# EAGLE design Grove-LED v1.0 (EAGLE 5.10)
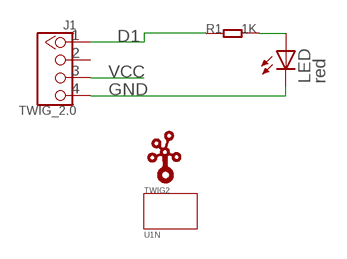
[diagram p0: schematic, sheet 1]

## Parts
J1  TWIG_2.0  [2.0_1X4]
LED  red  LED5MM  [LED5MM]
R1  1K  005-R0603  [0603]
TWIG2  U1N  [U1N]
U$1  TWIGLOGOTWIGLOGO_SMALL  [TWIGLOGO_SMALL]

## Nets
D1: J1.1 R1.1
GND: J1.4 LED.K(C)
N$1: LED.A R1.2
VCC: J1.3
Unconnected: J1.2

## Library data of the parts
J1 = CONNECTER:TWIG_2.0
LED = SparkFun:LED: LEDs Standard schematic elements and footprints for 5mm, 3mm, 1206, and 0603 sized LEDs. 5mm - Spark Fun Electronics SKU : COM-00529 (and others)
R1 = Discrete:005-R*
TWIG2 = twig_template1:U1N
U$1 = seeedleo:TWIGLOGO

## Board
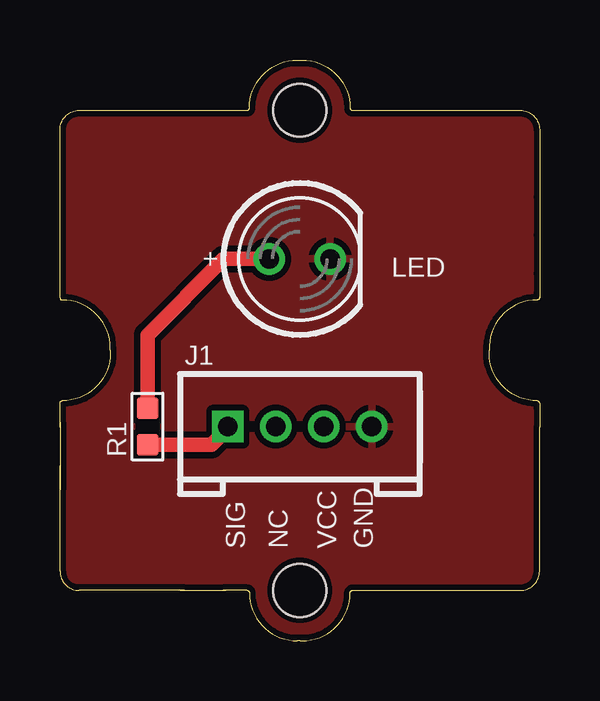
[diagram p1: board, top side]
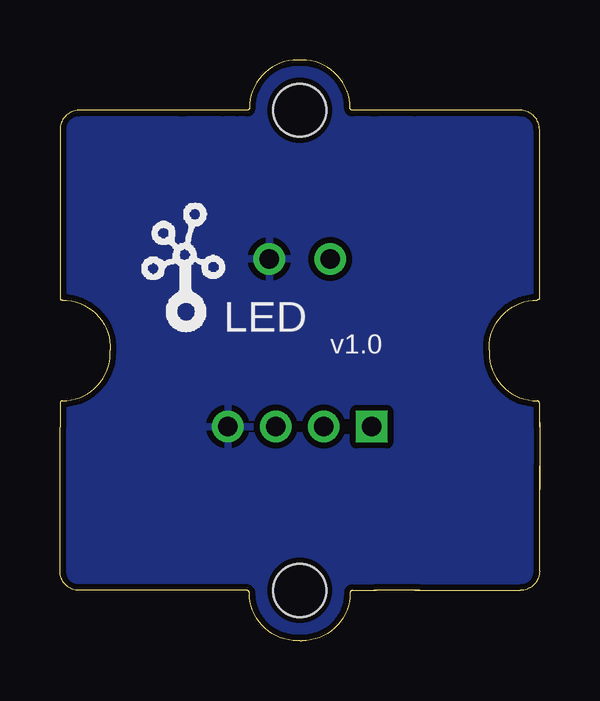
[diagram p2: board, bottom side, seen from below]

Size 20 x 24.2 mm. Coordinates in mm from the lower left corner, seen from the top.
Copper layers (1*16): Top 0.035mm / dielectric 1.5mm / Bottom 0.035mm
Design rules "SeeedStudio_rule_no_angle_090911": minimum track width 6mil, minimum drill 12mil, track to track 6mil, track to pad 6mil, pad to pad 6mil, via to via 6mil, smd to smd 0mil, copper to edge 10mil, drill to drill 10mil, minimum pad ring 10mil, minimum via ring 6mil, stop-mask expansion 2mil, vias tented up to drill 100mil, thermal gap 10mil

### Footprints (pad centres in the part's own frame; a part is rotated, then mirrored left to right if it is on the bottom)
2.0_1X4 = drill 0.8 pad 1.27 square: 1 -3,0 | drill 0.8 pad 1.27 round: 2 -1,0; 3 1,0; 4 3,0
LED5MM = drill 0.813 round: A -1.27,0; K 1.27,0
0603 = smd 0.889 x 0.889: 1 -0.762,0; 2 0.762,0
U1N = hole 2.2: 0,-10; 0,10

### Placement (x,y rotation side)
J1  10,8.93 0 top
LED  10,15.91 0 top
R1  3.65,8.93 90 top
TWIG2  10,12.1 0 top
U$1  16.98,12.73 0 bottom

### Tracks (layer width: path | path; a pad name or v marks a point on that pad's centre or on a via)
D1
  Top 0.61: J1.1 7,8.85 6.32,8.16 R1.1
GND
  pour Top (isolate 0.254): -0.16,24.8 20.16,24.8 20.16,-0.6 -0.16,-0.6
  pour Bottom (isolate 0.254): -0.16,24.8 20.16,24.8 20.16,-0.6 -0.16,-0.6
N$1
  Top 0.61: R1.2 3.65,12.73 6.83,15.91 LED.A

### Text on the board
tPlace: + | SIG | NC | VCC | GND
bPlace: LED | v1.0